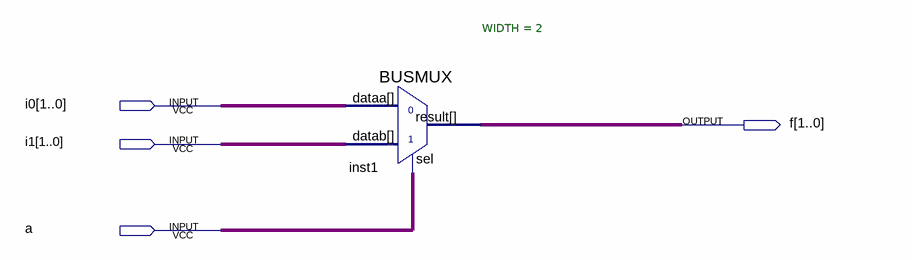
[diagram p0: schematic sheet]
// Quartus schematic lab8step1.bdf as structural Verilog: 1 symbols, 4 pins
module lab8step1 (
  input  [1:0] i0,
  input  [1:0] i1,
  input  a,
  output [1:0] f
);

  BUSMUX #(.WIDTH(2)) inst1 (.datab(i1), .sel(a), .dataa(i0), .result(f));
endmodule
